# Altium schematic sheet mux_gate.SchDoc
size 101 x 81 mm
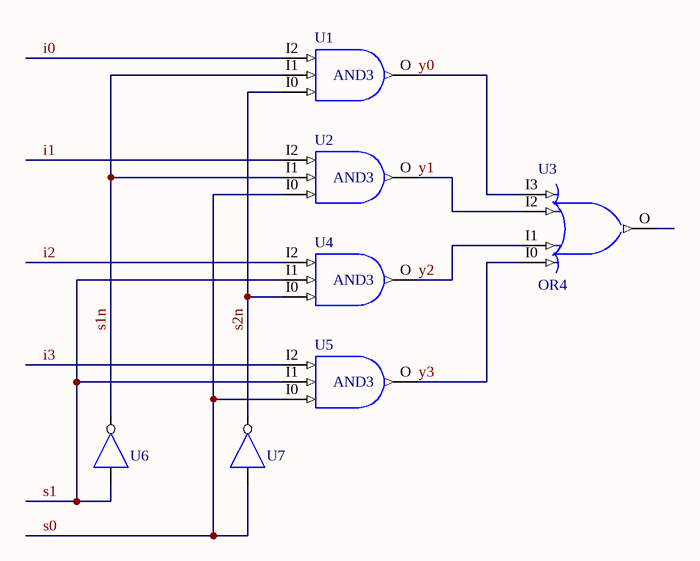
[diagram p0: mux_gate.SchDoc]

## Parts
U1  AND3
U2  AND3
U3  OR4
U4  AND3
U5  AND3
U6  not  (value not drawn)
U7  not  (value not drawn)

## Nets
i0: U1.I2
i1: U2.I2
i2: U4.I2
i3: U5.I2
s0: U2.I0 U5.I0 U7.i
s1: U4.I1 U5.I1 U6.i
s1n: U1.I1 U2.I1 U6.o
s2n: U1.I0 U4.I0 U7.o
y0: U1.O U3.I3
y1: U2.O U3.I2
y2: U3.I1 U4.O
y3: U3.I0 U5.O

Not connected (* = marked no-connect by the designer): U3 O

## Library data of the parts
U1 U2 U4 U5 = AND3: 3-Input AND Gate; FPGAVendor: CUPL; Published: 17/04/2002 5:24:18 PM; DatasheetDocument: 1999; Publisher: Altium Limited
U3 = OR4: 4-Input OR Gate; FPGAVendor: CUPL; Published: 17-Apr-2002; Publisher: Altium Limited
U6 U7 = BUF: 1-bit General Purpose (Non-inverting) Buffer